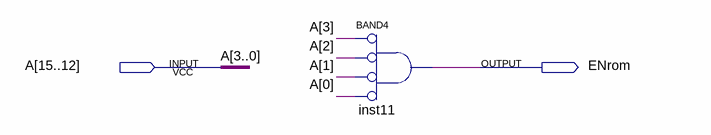
[diagram p0: schematic sheet]
// Quartus schematic CSrom.bdf as structural Verilog: 1 symbols, 2 pins
module CSrom (
  input  [15:12] A,
  output ENrom
);

  and inst11 (ENrom, ~A[15], ~A[14], ~A[13], ~A[12]);  // BAND4

  // Other names for the same wires on the sheet: A[3:0] = A
endmodule
